# Altium schematic sheet Team_Upsilon_Prj2_display_sch.SchDoc
size A; SheetNumber: 1; SheetTotal: 1
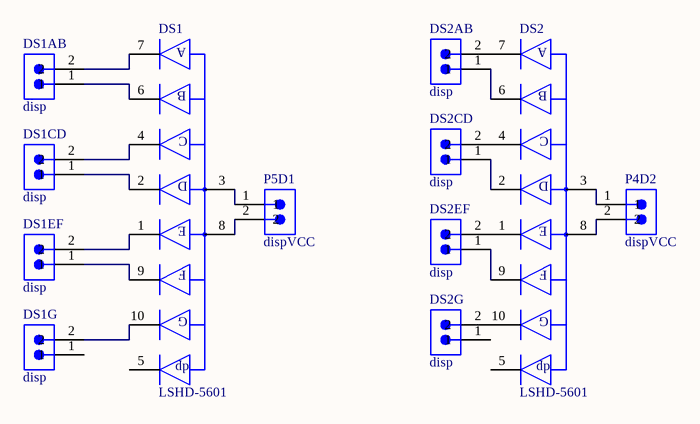
[diagram p0: Team_Upsilon_Prj2_display_sch.SchDoc]

## Parts
DS1  LSHD-5601  [FP-LSHD-5601-MFG]
DS1AB  disp  [61300211121]
DS1CD  disp  [61300211121]
DS1EF  disp  [61300211121]
DS1G  disp  [61300211121]
DS2  LSHD-5601  [FP-LSHD-5601-MFG]
DS2AB  disp  [61300211121]
DS2CD  disp  [61300211121]
DS2EF  disp  [61300211121]
DS2G  disp  [61300211121]
P4D2  dispVCC  [61300211121]
P5D1  dispVCC  [61300211121]

## Nets
NetDS1_1: DS1.1(CATHODE_E) DS1EF.2
NetDS1_2: DS1.2(CATHODE_D) DS1CD.1
NetDS1_3: DS1.3(COMMON_ANODE) P5D1.1
NetDS1_4: DS1.4(CATHODE_C) DS1CD.2
NetDS1_6: DS1.6(CATHODE_B) DS1AB.1
NetDS1_7: DS1.7(CATHODE_A) DS1AB.2
NetDS1_8: DS1.8(COMMON_ANODE) P5D1.2
NetDS1_9: DS1.9(CATHODE_F) DS1EF.1
NetDS1_10: DS1.10(CATHODE_G) DS1G.2
NetDS2_1: DS2.1(CATHODE_E) DS2EF.2
NetDS2_2: DS2.2(CATHODE_D) DS2CD.1
NetDS2_3: DS2.3(COMMON_ANODE) P4D2.1
NetDS2_4: DS2.4(CATHODE_C) DS2CD.2
NetDS2_6: DS2.6(CATHODE_B) DS2AB.1
NetDS2_7: DS2.7(CATHODE_A) DS2AB.2
NetDS2_8: DS2.8(COMMON_ANODE) P4D2.2
NetDS2_9: DS2.9(CATHODE_F) DS2EF.1
NetDS2_10: DS2.10(CATHODE_G) DS2G.2

Not connected (* = marked no-connect by the designer): DS1 5(CATHODE_DP); DS1G 1; DS2 5(CATHODE_DP); DS2G 1

## Notes on the sheet
- (in symbol CMP-22013-000002-1) A; B; C; D; E; F; G; dp

## Library data of the parts
DS1 DS2 = CMP-22013-000002-1: LED 7-SEG .56" GREEN 565NM CA; Manufacturer: Lite-On; Wavelength: 569nm; Luminous Intensity: 2.4mcd; Forward Current: 20mA; Forward Voltage: 2.1V; Element Config: Common Anode; Reverse Voltage: 5V; Device Class L1: Optoelectronics; ComponentLink2URL: https://media.digikey.com/pdf/Data%20Sheets/Lite-On%20PDFs/LSHD-5601.pdf; Temperature Range High: +105°C; ComponentLink2Description: Datasheet; Automotive: No; Temperature: -35°C to +105°C; Mouser Description: LED Displays & Accessories Green, Low Current 0.56, CARHD; Package: LSHD-5601; Device Class L3: LED Displays; Height: 8.25mm; Digikey Description: LED 7-SEG .56" GREEN 565NM CA; Category: Disp; Display Type: LED; Octopart: https://octopart.com/lshd-5601-lite-on-548440; Lead Free: Yes; Temperature Range Low: -35°C; RoHS: TRUE; Test Current: 20mA; Manufacturer Part Number: LSHD-5601; Device Class L2: Displays
DS1AB DS1CD DS1EF DS1G DS2AB DS2CD DS2EF DS2G = CMP-1712-00002-6: NexarPartId: 20081794; Number of Contacts: 2; Pitch: 2.54mm; Connector Type: Male Pin; Voltage Rating: 250V; Current Rating: 3A; Gender: Male; Color: Black; Contact Resistance: 20mΩ; Height: 8.94mm; Lead Free: Lead Free; Number of Pins: 2; Termination: Through Hole; RoHS: Compliant; Lead Pitch: 2.54mm; REACH SVHC: No SVHC; Housing Material: PBT; Contact Mating Length: 5.9944mm; Min Operating Temperature: -40°C; Orientation: Vertical; Contact Material: Copper; Contact Gender: Male; Max Operating Temperature: 125°C; Number of Rows: 1; Number of Positions: 2; Packaging: Bulk; Contact Plating: Gold; Mount: Through Hole; Operating Supply Voltage: 250V
P4D2 P5D1 = CMP-1712-00002-6: NexarPartId: 20081794; Number of Contacts: 2; Pitch: 2.54mm; Connector Type: Male Pin; Voltage Rating: 250V; Current Rating: 3A; Gender: Male; Contact Resistance: 20mΩ; Height: 8.94mm; Lead Free: Lead Free; Number of Pins: 2; Termination: Through Hole; RoHS: Compliant; Lead Pitch: 2.54mm; REACH SVHC: No SVHC; Housing Material: PBT; Contact Mating Length: 5.9944mm; Min Operating Temperature: -40°C; Orientation: Vertical; Contact Material: Copper; Contact Gender: Male; Max Operating Temperature: 125°C; Number of Rows: 1; Number of Positions: 2; Packaging: Bulk; Contact Plating: Gold; Mount: Through Hole; Color: Black; Operating Supply Voltage: 250V